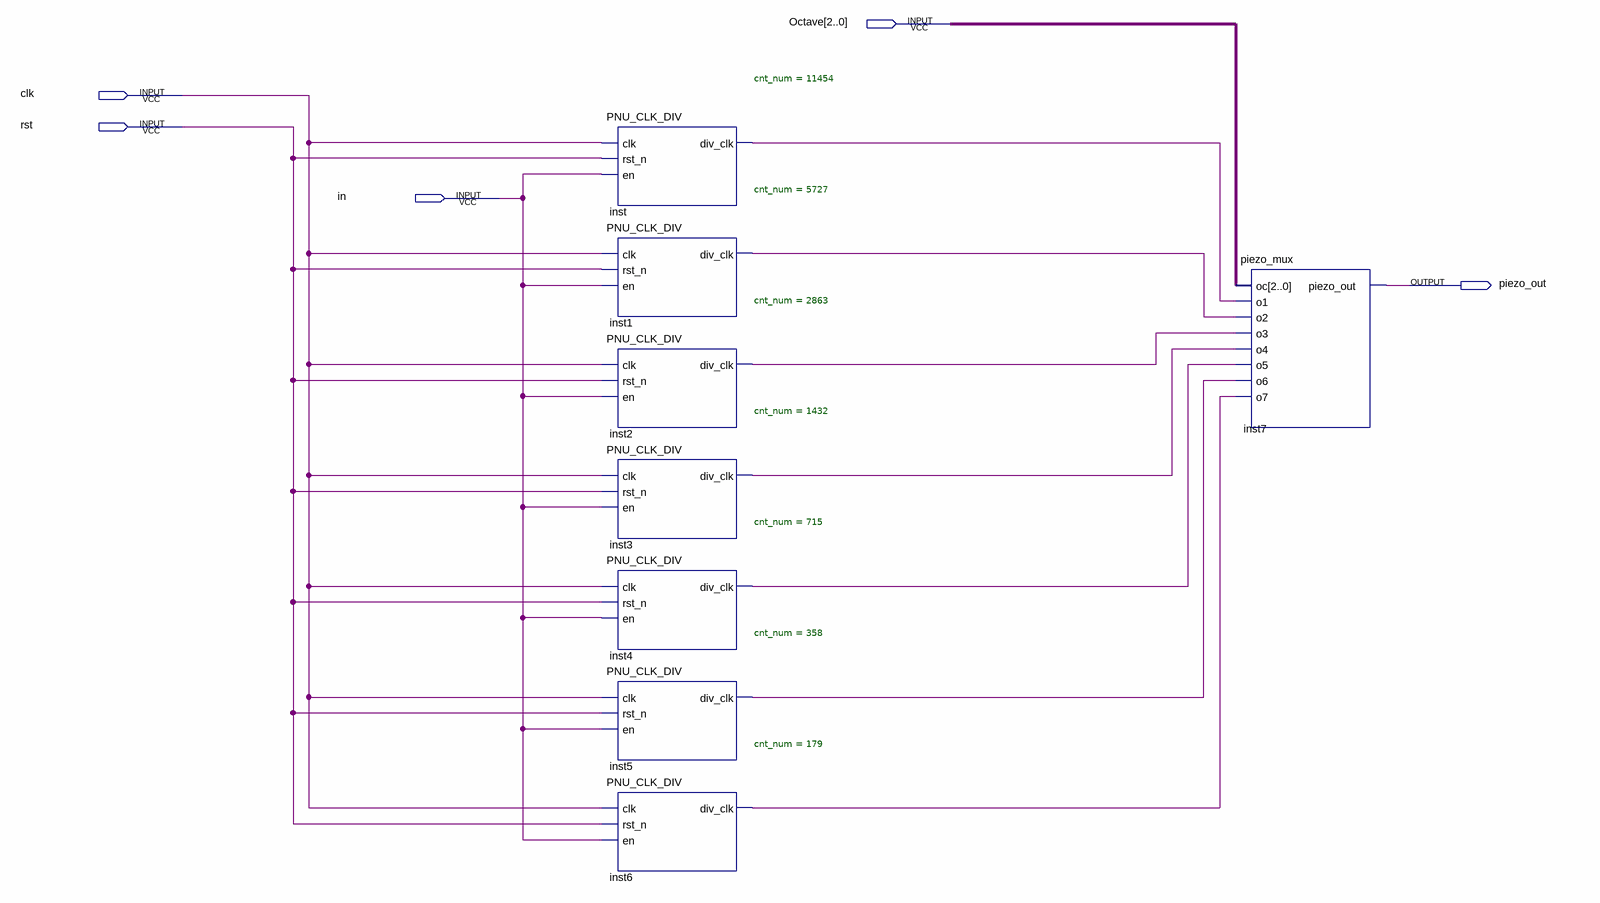
[diagram p0: schematic sheet]
// Quartus schematic F.bdf as structural Verilog: 8 symbols, 5 pins
module F (
  input  [2:0] Octave,
  input  clk,
  input  rst,
  input  in,
  output piezo_out
);

  wire inst1_div_clk, inst2_div_clk, inst3_div_clk, inst4_div_clk, inst5_div_clk, inst6_div_clk, inst_div_clk;

  PNU_CLK_DIV #(.cnt_num(11454)) inst (.clk(clk), .rst_n(rst), .en(in), .div_clk(inst_div_clk));
  PNU_CLK_DIV #(.cnt_num(5727)) inst1 (.clk(clk), .rst_n(rst), .en(in), .div_clk(inst1_div_clk));
  PNU_CLK_DIV #(.cnt_num(2863)) inst2 (.clk(clk), .rst_n(rst), .en(in), .div_clk(inst2_div_clk));
  PNU_CLK_DIV #(.cnt_num(1432)) inst3 (.clk(clk), .rst_n(rst), .en(in), .div_clk(inst3_div_clk));
  PNU_CLK_DIV #(.cnt_num(715)) inst4 (.clk(clk), .rst_n(rst), .en(in), .div_clk(inst4_div_clk));
  PNU_CLK_DIV #(.cnt_num(358)) inst5 (.clk(clk), .rst_n(rst), .en(in), .div_clk(inst5_div_clk));
  PNU_CLK_DIV #(.cnt_num(179)) inst6 (.clk(clk), .rst_n(rst), .en(in), .div_clk(inst6_div_clk));
  piezo_mux inst7 (
    .oc(Octave), .o1(inst_div_clk), .o2(inst1_div_clk), .o3(inst2_div_clk), .o4(inst3_div_clk),
    .o5(inst4_div_clk), .o6(inst5_div_clk), .o7(inst6_div_clk), .piezo_out(piezo_out));
endmodule
